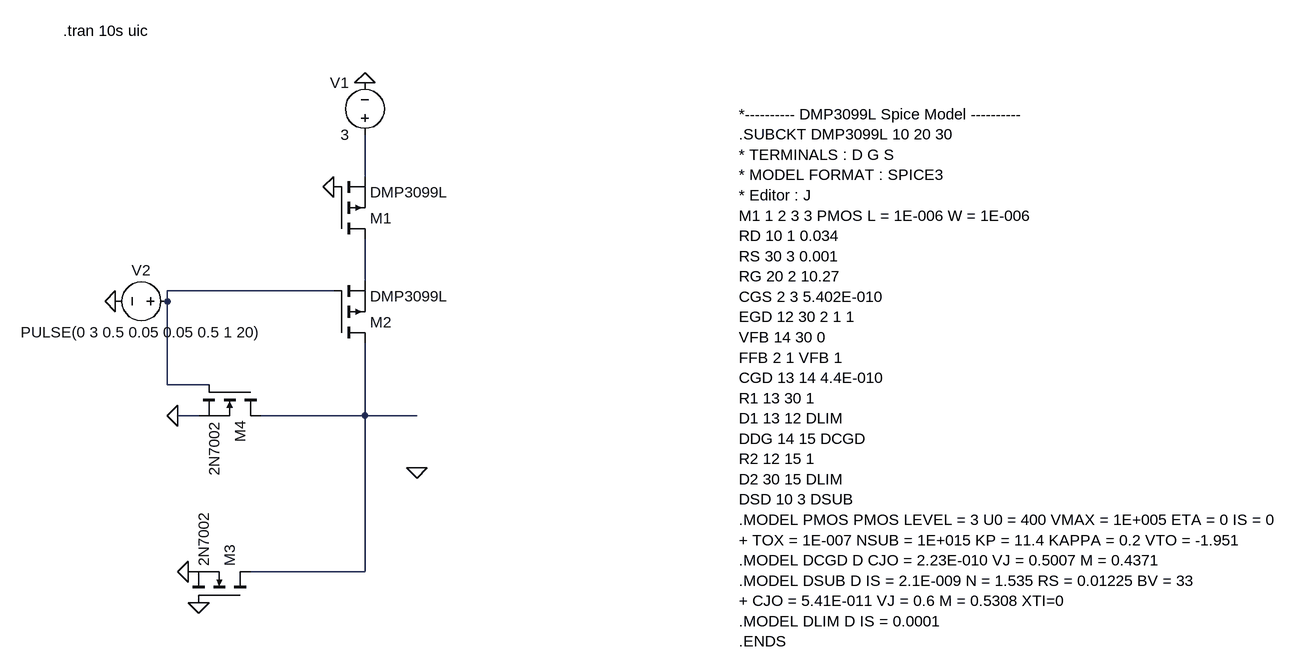
[diagram p0: schematic or-gate.asc]
or-gate.asc, the LTspice schematic file:
Version 4.1
SHEET 1 1772 708
WIRE 336 32 336 -32
WIRE 336 192 336 128
WIRE 288 208 32 208
WIRE 32 224 32 208
WIRE 32 352 32 224
WIRE 96 352 32 352
WIRE 80 400 48 400
WIRE 336 400 336 288
WIRE 336 400 176 400
WIRE 416 400 336 400
WIRE 336 640 336 400
WIRE 336 640 160 640
FLAG 288 48 0
FLAG 48 400 0
FLAG 64 640 0
FLAG 80 688 0
FLAG -48 224 0
FLAG 416 480 0
FLAG 336 -112 0
SYMBOL pmos 288 128 M180
SYMATTR InstName M1
SYMATTR Value DMP3099L
SYMATTR Prefix X
SYMBOL pmos 288 288 M180
SYMATTR InstName M2
SYMATTR Value DMP3099L
SYMATTR Prefix X
SYMBOL voltage 336 -16 R180
WINDOW 0 24 96 Left 2
WINDOW 3 24 16 Left 2
WINDOW 123 0 0 Left 0
WINDOW 39 0 0 Left 0
SYMATTR InstName V1
SYMATTR Value 3
SYMBOL nmos 160 688 M270
SYMATTR InstName M3
SYMATTR Value 2N7002
SYMBOL nmos 176 352 R90
SYMATTR InstName M4
SYMATTR Value 2N7002
SYMBOL voltage 48 224 R90
WINDOW 0 -32 56 VBottom 2
WINDOW 3 32 56 VTop 2
WINDOW 123 0 0 Left 0
WINDOW 39 0 0 Left 0
SYMATTR InstName V2
SYMATTR Value PULSE(0 3 0.5 0.05 0.05 0.5 1 20)
TEXT 912 -64 Left 2 !*---------- DMP3099L Spice Model ----------\n.SUBCKT DMP3099L 10 20 30\n* TERMINALS : D G S\n* MODEL FORMAT : SPICE3\n* Editor : J\nM1 1 2 3 3 PMOS L = 1E-006 W = 1E-006\nRD 10 1 0.034\nRS 30 3 0.001\nRG 20 2 10.27\nCGS 2 3 5.402E-010\nEGD 12 30 2 1 1\nVFB 14 30 0\nFFB 2 1 VFB 1\nCGD 13 14 4.4E-010\nR1 13 30 1\nD1 13 12 DLIM\nDDG 14 15 DCGD\nR2 12 15 1\nD2 30 15 DLIM\nDSD 10 3 DSUB\n.MODEL PMOS PMOS LEVEL = 3 U0 = 400 VMAX = 1E+005 ETA = 0 IS = 0\n+ TOX = 1E-007 NSUB = 1E+015 KP = 11.4 KAPPA = 0.2 VTO = -1.951\n.MODEL DCGD D CJO = 2.23E-010 VJ = 0.5007 M = 0.4371\n.MODEL DSUB D IS = 2.1E-009 N = 1.535 RS = 0.01225 BV = 33\n+ CJO = 5.41E-011 VJ = 0.6 M = 0.5308 XTI=0\n.MODEL DLIM D IS = 0.0001\n.ENDS
TEXT -128 -192 Left 2 !.tran 10s uic

The netlist it stands for:
* or-gate.asc
X§M1 N002 0 N001 DMP3099L  ; pins D G S
X§M2 N004 N003 N002 DMP3099L  ; pins D G S
V1 N001 0 3
M3 N004 0 0 0 2N7002
M4 N004 N003 0 0 2N7002
V2 N003 0 PULSE(0 3 0.5 0.05 0.05 0.5 1 20)
.model NMOS NMOS
.model PMOS PMOS
.lib standard.mos
*---------- DMP3099L Spice Model ----------
.SUBCKT DMP3099L 10 20 30
* TERMINALS : D G S
* MODEL FORMAT : SPICE3
* Editor : J
M1 1 2 3 3 PMOS L = 1E-006 W = 1E-006
RD 10 1 0.034
RS 30 3 0.001
RG 20 2 10.27
CGS 2 3 5.402E-010
EGD 12 30 2 1 1
VFB 14 30 0
FFB 2 1 VFB 1
CGD 13 14 4.4E-010
R1 13 30 1
D1 13 12 DLIM
DDG 14 15 DCGD
R2 12 15 1
D2 30 15 DLIM
DSD 10 3 DSUB
.MODEL PMOS PMOS LEVEL = 3 U0 = 400 VMAX = 1E+005 ETA = 0 IS = 0
+ TOX = 1E-007 NSUB = 1E+015 KP = 11.4 KAPPA = 0.2 VTO = -1.951
.MODEL DCGD D CJO = 2.23E-010 VJ = 0.5007 M = 0.4371
.MODEL DSUB D IS = 2.1E-009 N = 1.535 RS = 0.01225 BV = 33
+ CJO = 5.41E-011 VJ = 0.6 M = 0.5308 XTI=0
.MODEL DLIM D IS = 0.0001
.ENDS
.tran 10s uic
.backanno
.end